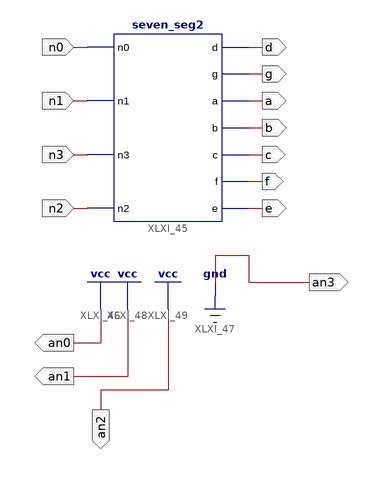
[diagram p0: schematic sheet 1]
// Xilinx ISE schematic test_bench.sch (spartan3e) as structural Verilog: 1 symbols, 15 ports
module test_bench (
  input  n0,
  input  n1,
  input  n3,
  input  n2,
  output e,
  output f,
  output c,
  output b,
  output a,
  output g,
  output d,
  output an3,
  output an2,
  output an1,
  output an0
);

  seven_seg2 XLXI_45 (.n0(n0), .n1(n1), .n3(n3), .n2(n2), .d(d), .g(g), .a(a), .b(b), .c(c), .f(f), .e(e));

  assign an0 = 1'b1;
  assign an1 = 1'b1;
  assign an2 = 1'b1;
  assign an3 = 1'b0;
endmodule
